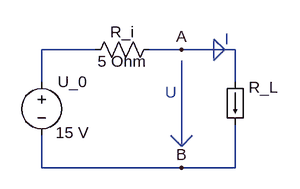
[diagram p0: schematic part01-voltage-source.asc]
part01-voltage-source.asc, the LTspice schematic file:
Version 4.1
SHEET 1 880 680
WIRE 128 -144 48 -144
WIRE 256 -144 208 -144
WIRE 336 -144 256 -144
WIRE 48 -96 48 -144
WIRE 336 -96 336 -144
WIRE 48 32 48 -16
WIRE 256 32 48 32
WIRE 336 32 336 -32
WIRE 336 32 256 32
FLAG 256 -144 A
FLAG 256 32 B
SYMBOL voltage 48 -112 R0
WINDOW 3 21 92 Left 2
WINDOW 123 0 0 Left 0
WINDOW 39 0 0 Left 0
SYMATTR Value 15 V
SYMATTR InstName U_0
SYMBOL res 224 -160 R90
WINDOW 0 5 56 VBottom 2
WINDOW 3 49 56 VBottom 2
SYMATTR InstName R_i
SYMATTR Value 5 Ohm
SYMBOL load 320 -96 R0
SYMATTR InstName R_L
SYMATTR Value ""
TEXT 320 -160 Left 2 ;I
TEXT 232 -80 Left 2 ;U
LINE Normal 304 -160 320 -144
LINE Normal 304 -128 320 -144
LINE Normal 304 -160 304 -128
LINE Normal 256 0 256 -128
LINE Normal 240 -16 256 0
LINE Normal 256 0 240 -16
LINE Normal 272 -16 256 0

The netlist it stands for:
* part01-voltage-source.asc
V§U_0 N001 B 15 V
R_i A N001 5 Ohm
I§R_L A B
* I
* U
.backanno
.end